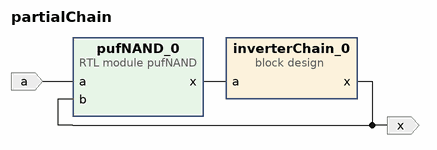
[diagram p0: block diagram of the top level]
# Vivado block design partialChain, xc7z020clg484-1, Vivado 2024.2
create_bd_design partialChain

create_bd_port -dir O x
create_bd_port -dir I a

create_bd_cell -type container -reference inverterChain inverterChain_0
set_property -dict [list \
  CONFIG.ACTIVE_SIM_BD inverterChain.bd \
  CONFIG.ACTIVE_SYNTH_BD inverterChain.bd \
  CONFIG.ENABLE_DFX 0 \
  CONFIG.LIST_SIM_BD inverterChain.bd \
  CONFIG.LIST_SYNTH_BD inverterChain.bd \
  CONFIG.LOCK_PROPAGATE 0 \
] [get_bd_cells inverterChain_0]
create_bd_cell -type module -reference pufNAND pufNAND_0

# ---- connections ----

connect_bd_net [get_bd_ports a] [get_bd_pins pufNAND_0/a]
connect_bd_net [get_bd_pins inverterChain_0/x] [get_bd_ports x] [get_bd_pins pufNAND_0/b]
connect_bd_net [get_bd_pins pufNAND_0/x] [get_bd_pins inverterChain_0/a]

validate_bd_design
save_bd_design
